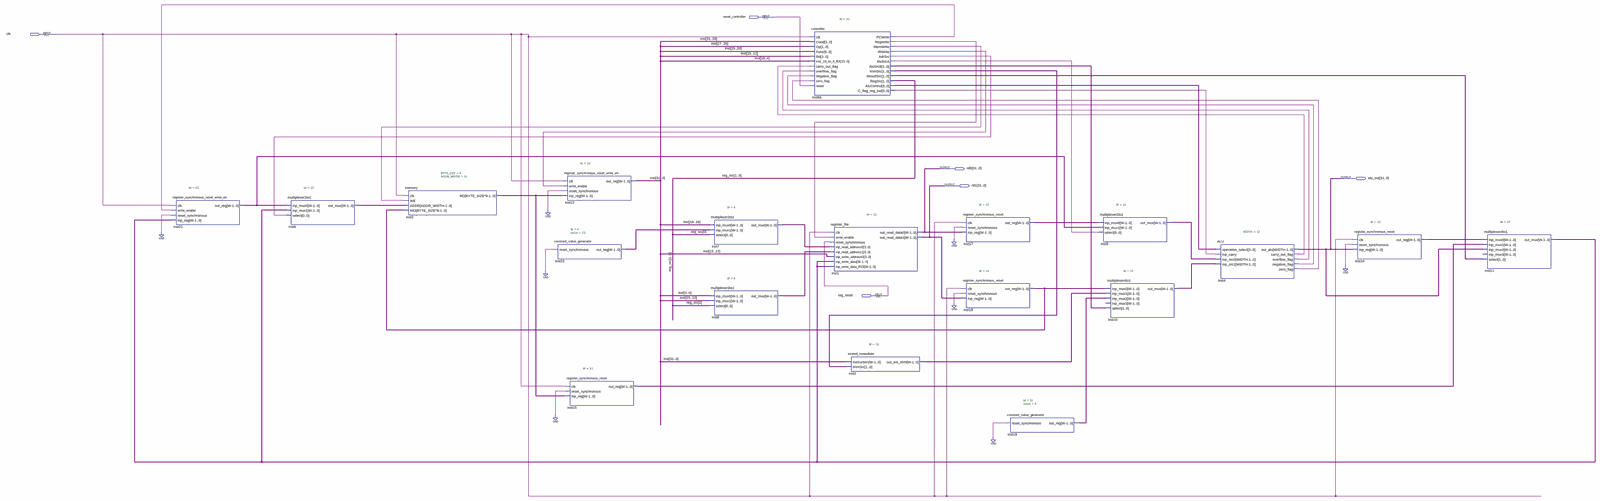
[diagram p0: schematic sheet, whole]
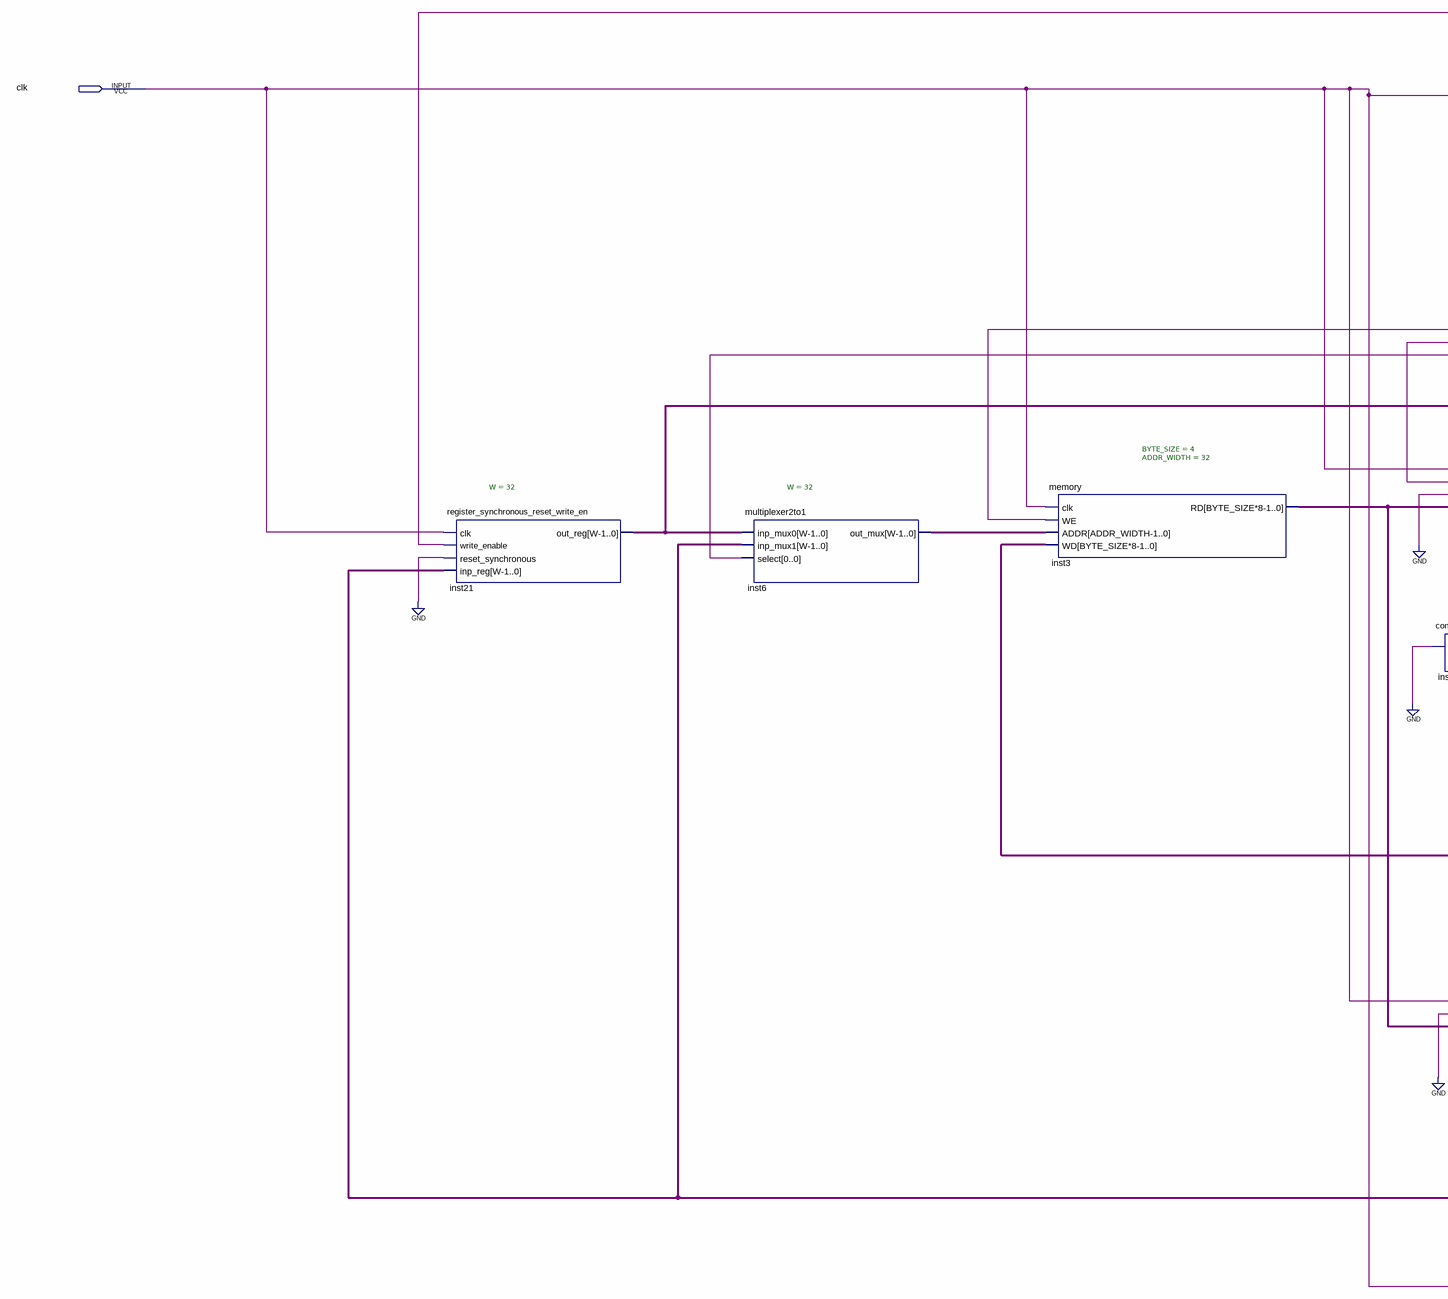
[diagram p1: schematic sheet, left part]
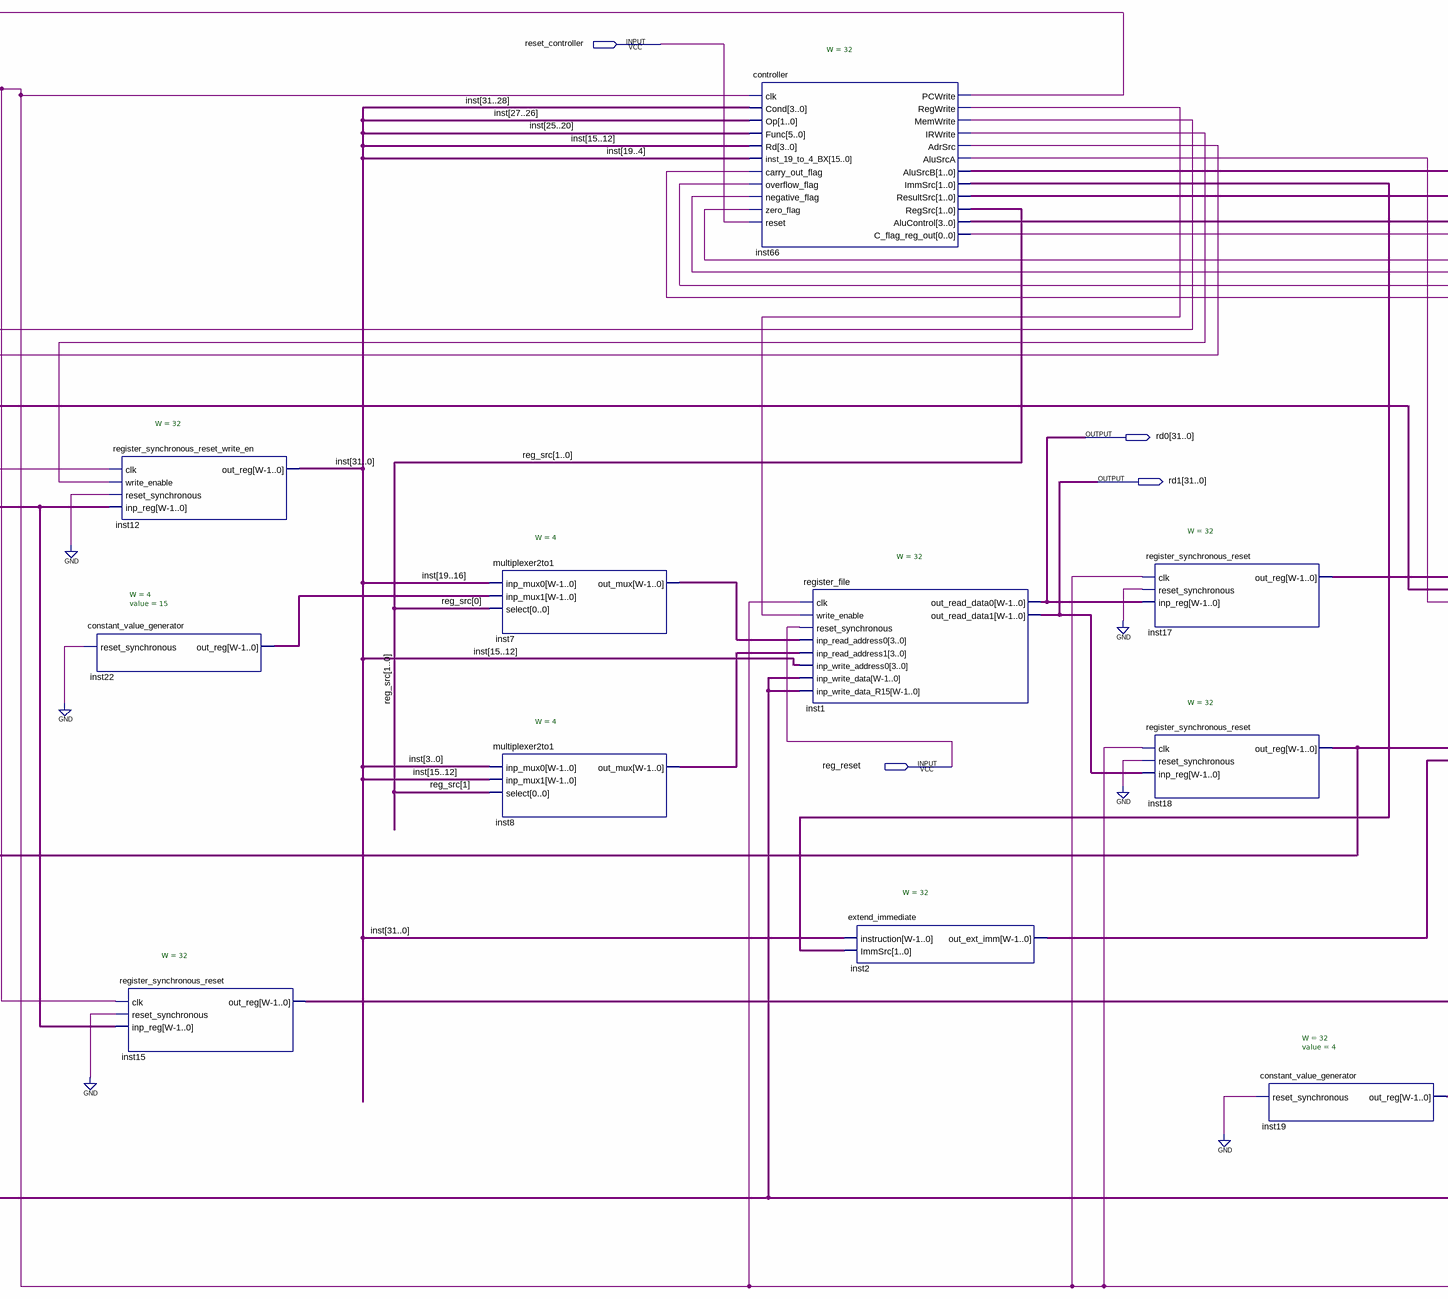
[diagram p2: schematic sheet, centre part]
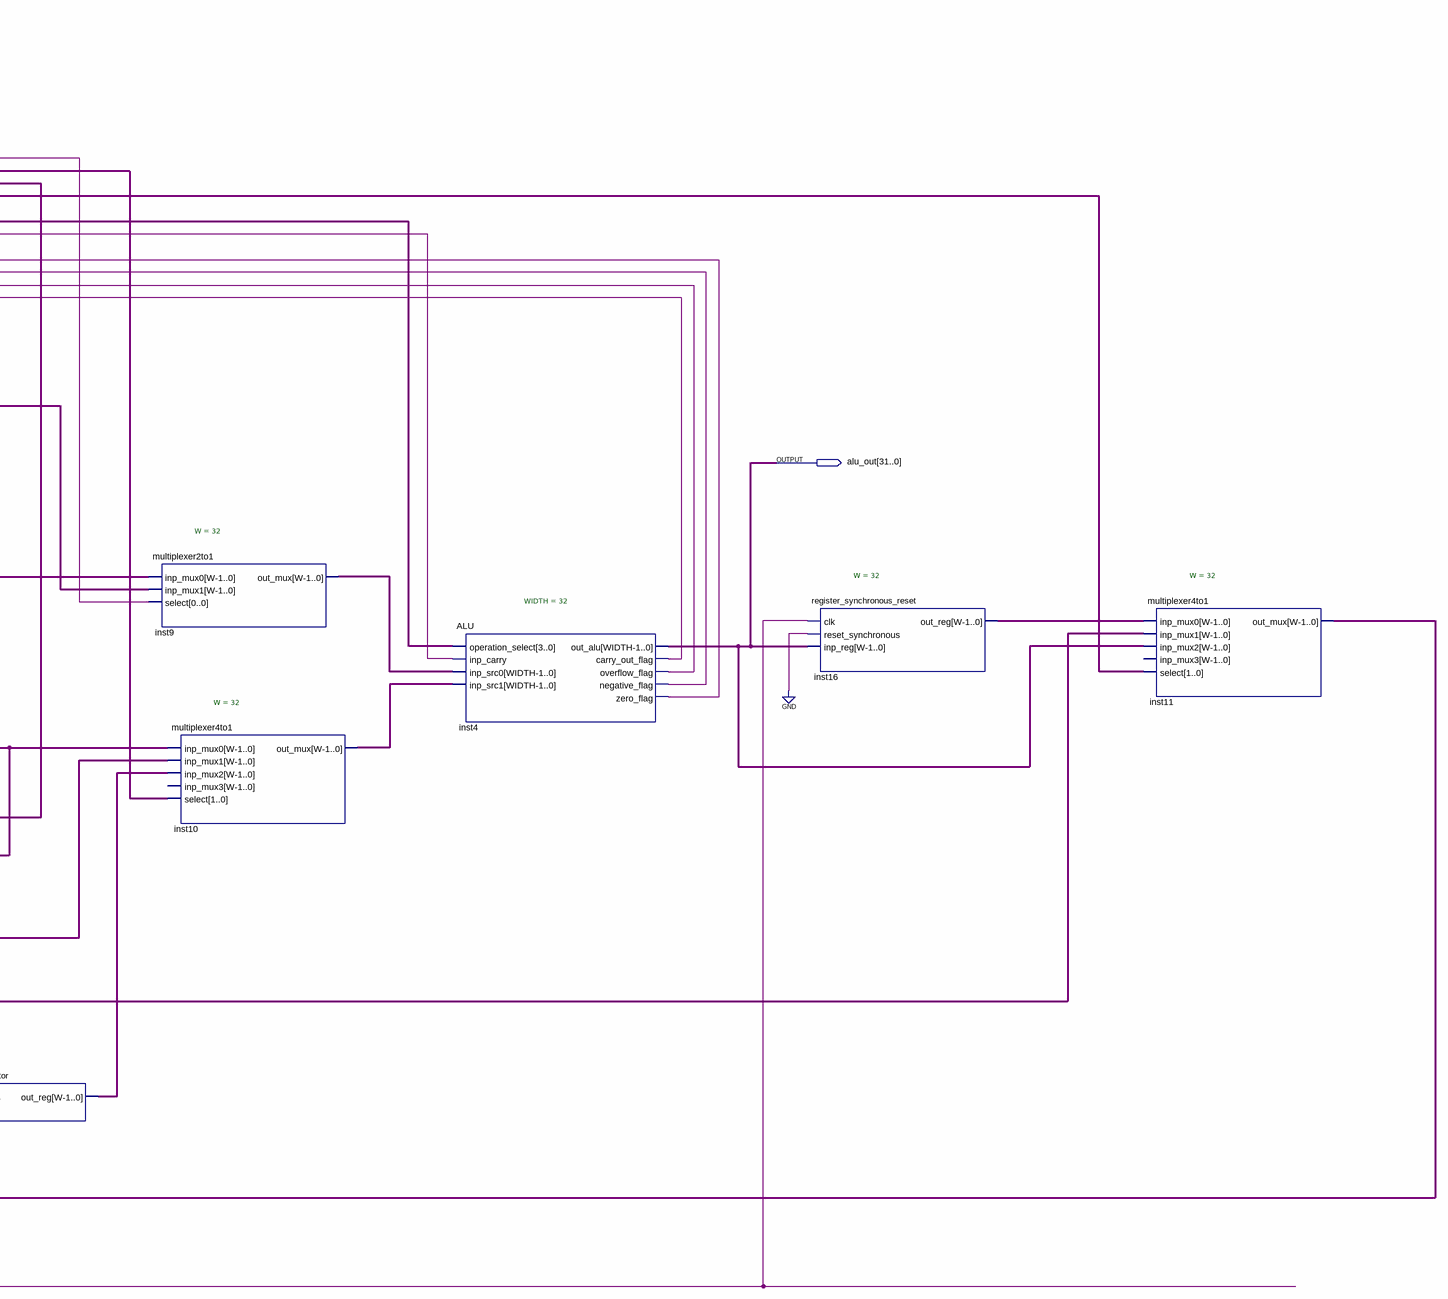
[diagram p3: schematic sheet, right part]
// Quartus schematic data_path_3.bdf as structural Verilog: 19 symbols, 6 pins
module data_path_3 (
  input  reset_controller,
  input  clk,
  input  reg_reset,
  output [31:0] rd0,
  output [31:0] alu_out,
  output [31:0] rd1
);

  wire inst4_carry_out_flag, inst4_negative_flag, inst4_overflow_flag, inst4_zero_flag, inst66_adrsrc,
       inst66_alusrca, inst66_c_flag_reg_out, inst66_irwrite, inst66_memwrite, inst66_pcwrite,
       inst66_regwrite;
  wire [1:0] inst66_alusrcb, inst66_immsrc, inst66_resultsrc, reg_src;
  wire [3:0] inst7_out_mux, inst8_out_mux, inst22_out_reg, inst66_alucontrol;
  wire [31:0] inst, inst2_out_ext_imm, inst3_rd, inst6_out_mux, inst9_out_mux, inst10_out_mux,
       inst11_out_mux, inst15_out_reg, inst16_out_reg, inst17_out_reg, inst18_out_reg, inst19_out_reg,
       inst21_out_reg;

  register_synchronous_reset_write_en #(.W(32)) inst21 (
    .clk(clk), .write_enable(inst66_pcwrite), .reset_synchronous(1'b0), .inp_reg(inst11_out_mux),
    .out_reg(inst21_out_reg));
  multiplexer2to1 #(.W(32)) inst6 (
    .inp_mux0(inst21_out_reg), .inp_mux1(inst11_out_mux), .select(inst66_adrsrc), .out_mux(inst6_out_mux));
  memory #(.BYTE_SIZE(4), .ADDR_WIDTH(32)) inst3 (
    .clk(clk), .WE(inst66_memwrite), .ADDR(inst6_out_mux), .WD(inst18_out_reg), .RD(inst3_rd));
  register_synchronous_reset_write_en #(.W(32)) inst12 (
    .clk(clk), .write_enable(inst66_irwrite), .reset_synchronous(1'b0), .inp_reg(inst3_rd), .out_reg(inst));
  constant_value_generator #(.W(4), .value(15)) inst22 (.reset_synchronous(1'b0), .out_reg(inst22_out_reg));
  register_synchronous_reset #(.W(32)) inst15 (
    .clk(clk), .reset_synchronous(1'b0), .inp_reg(inst3_rd), .out_reg(inst15_out_reg));
  multiplexer2to1 #(.W(4)) inst7 (
    .inp_mux0(inst[19:16]), .inp_mux1(inst22_out_reg), .select(reg_src[0]), .out_mux(inst7_out_mux));
  multiplexer2to1 #(.W(4)) inst8 (
    .inp_mux0(inst[3:0]), .inp_mux1(inst[15:12]), .select(reg_src[1]), .out_mux(inst8_out_mux));
  controller #(.W(32)) inst66 (
    .clk(clk), .Cond(inst[31:28]), .Op(inst[27:26]), .Func(inst[25:20]), .Rd(inst[15:12]),
    .inst_19_to_4_BX(inst[19:4]), .carry_out_flag(inst4_carry_out_flag), .overflow_flag(inst4_overflow_flag),
    .negative_flag(inst4_negative_flag), .zero_flag(inst4_zero_flag), .reset(reset_controller),
    .PCWrite(inst66_pcwrite), .RegWrite(inst66_regwrite), .MemWrite(inst66_memwrite),
    .IRWrite(inst66_irwrite), .AdrSrc(inst66_adrsrc), .AluSrcA(inst66_alusrca), .AluSrcB(inst66_alusrcb),
    .ImmSrc(inst66_immsrc), .ResultSrc(inst66_resultsrc), .RegSrc(reg_src), .AluControl(inst66_alucontrol),
    .C_flag_reg_out(inst66_c_flag_reg_out));
  register_file #(.W(32)) inst1 (
    .clk(clk), .write_enable(inst66_regwrite), .reset_synchronous(reg_reset),
    .inp_read_address0(inst7_out_mux), .inp_read_address1(inst8_out_mux), .inp_write_address0(inst[15:12]),
    .inp_write_data(inst11_out_mux), .inp_write_data_R15(inst11_out_mux), .out_read_data0(rd0),
    .out_read_data1(rd1));
  extend_immediate #(.W(32)) inst2 (.instruction(inst), .ImmSrc(inst66_immsrc), .out_ext_imm(inst2_out_ext_imm));
  register_synchronous_reset #(.W(32)) inst17 (
    .clk(clk), .reset_synchronous(1'b0), .inp_reg(rd0), .out_reg(inst17_out_reg));
  register_synchronous_reset #(.W(32)) inst18 (
    .clk(clk), .reset_synchronous(1'b0), .inp_reg(rd1), .out_reg(inst18_out_reg));
  constant_value_generator #(.W(32), .value(4)) inst19 (.reset_synchronous(1'b0), .out_reg(inst19_out_reg));
  multiplexer2to1 #(.W(32)) inst9 (
    .inp_mux0(inst17_out_reg), .inp_mux1(inst21_out_reg), .select(inst66_alusrca), .out_mux(inst9_out_mux));
  multiplexer4to1 #(.W(32)) inst10 (
    .inp_mux0(inst18_out_reg), .inp_mux1(inst2_out_ext_imm), .inp_mux2(inst19_out_reg),
    .select(inst66_alusrcb), .out_mux(inst10_out_mux));  // open: inp_mux3
  ALU #(.WIDTH(32)) inst4 (
    .operation_select(inst66_alucontrol), .inp_carry(inst66_c_flag_reg_out), .inp_src0(inst9_out_mux),
    .inp_src1(inst10_out_mux), .out_alu(alu_out), .carry_out_flag(inst4_carry_out_flag),
    .overflow_flag(inst4_overflow_flag), .negative_flag(inst4_negative_flag), .zero_flag(inst4_zero_flag));
  register_synchronous_reset #(.W(32)) inst16 (
    .clk(clk), .reset_synchronous(1'b0), .inp_reg(alu_out), .out_reg(inst16_out_reg));
  multiplexer4to1 #(.W(32)) inst11 (
    .inp_mux0(inst16_out_reg), .inp_mux1(inst15_out_reg), .inp_mux2(alu_out), .select(inst66_resultsrc),
    .out_mux(inst11_out_mux));  // open: inp_mux3
endmodule
